# Altium schematic sheet Block_Scheme.SchDoc
size 420 x 297 mm; DocumentNumber: СКТБ.100.001 Э3; SheetNumber: 4; Format: A3
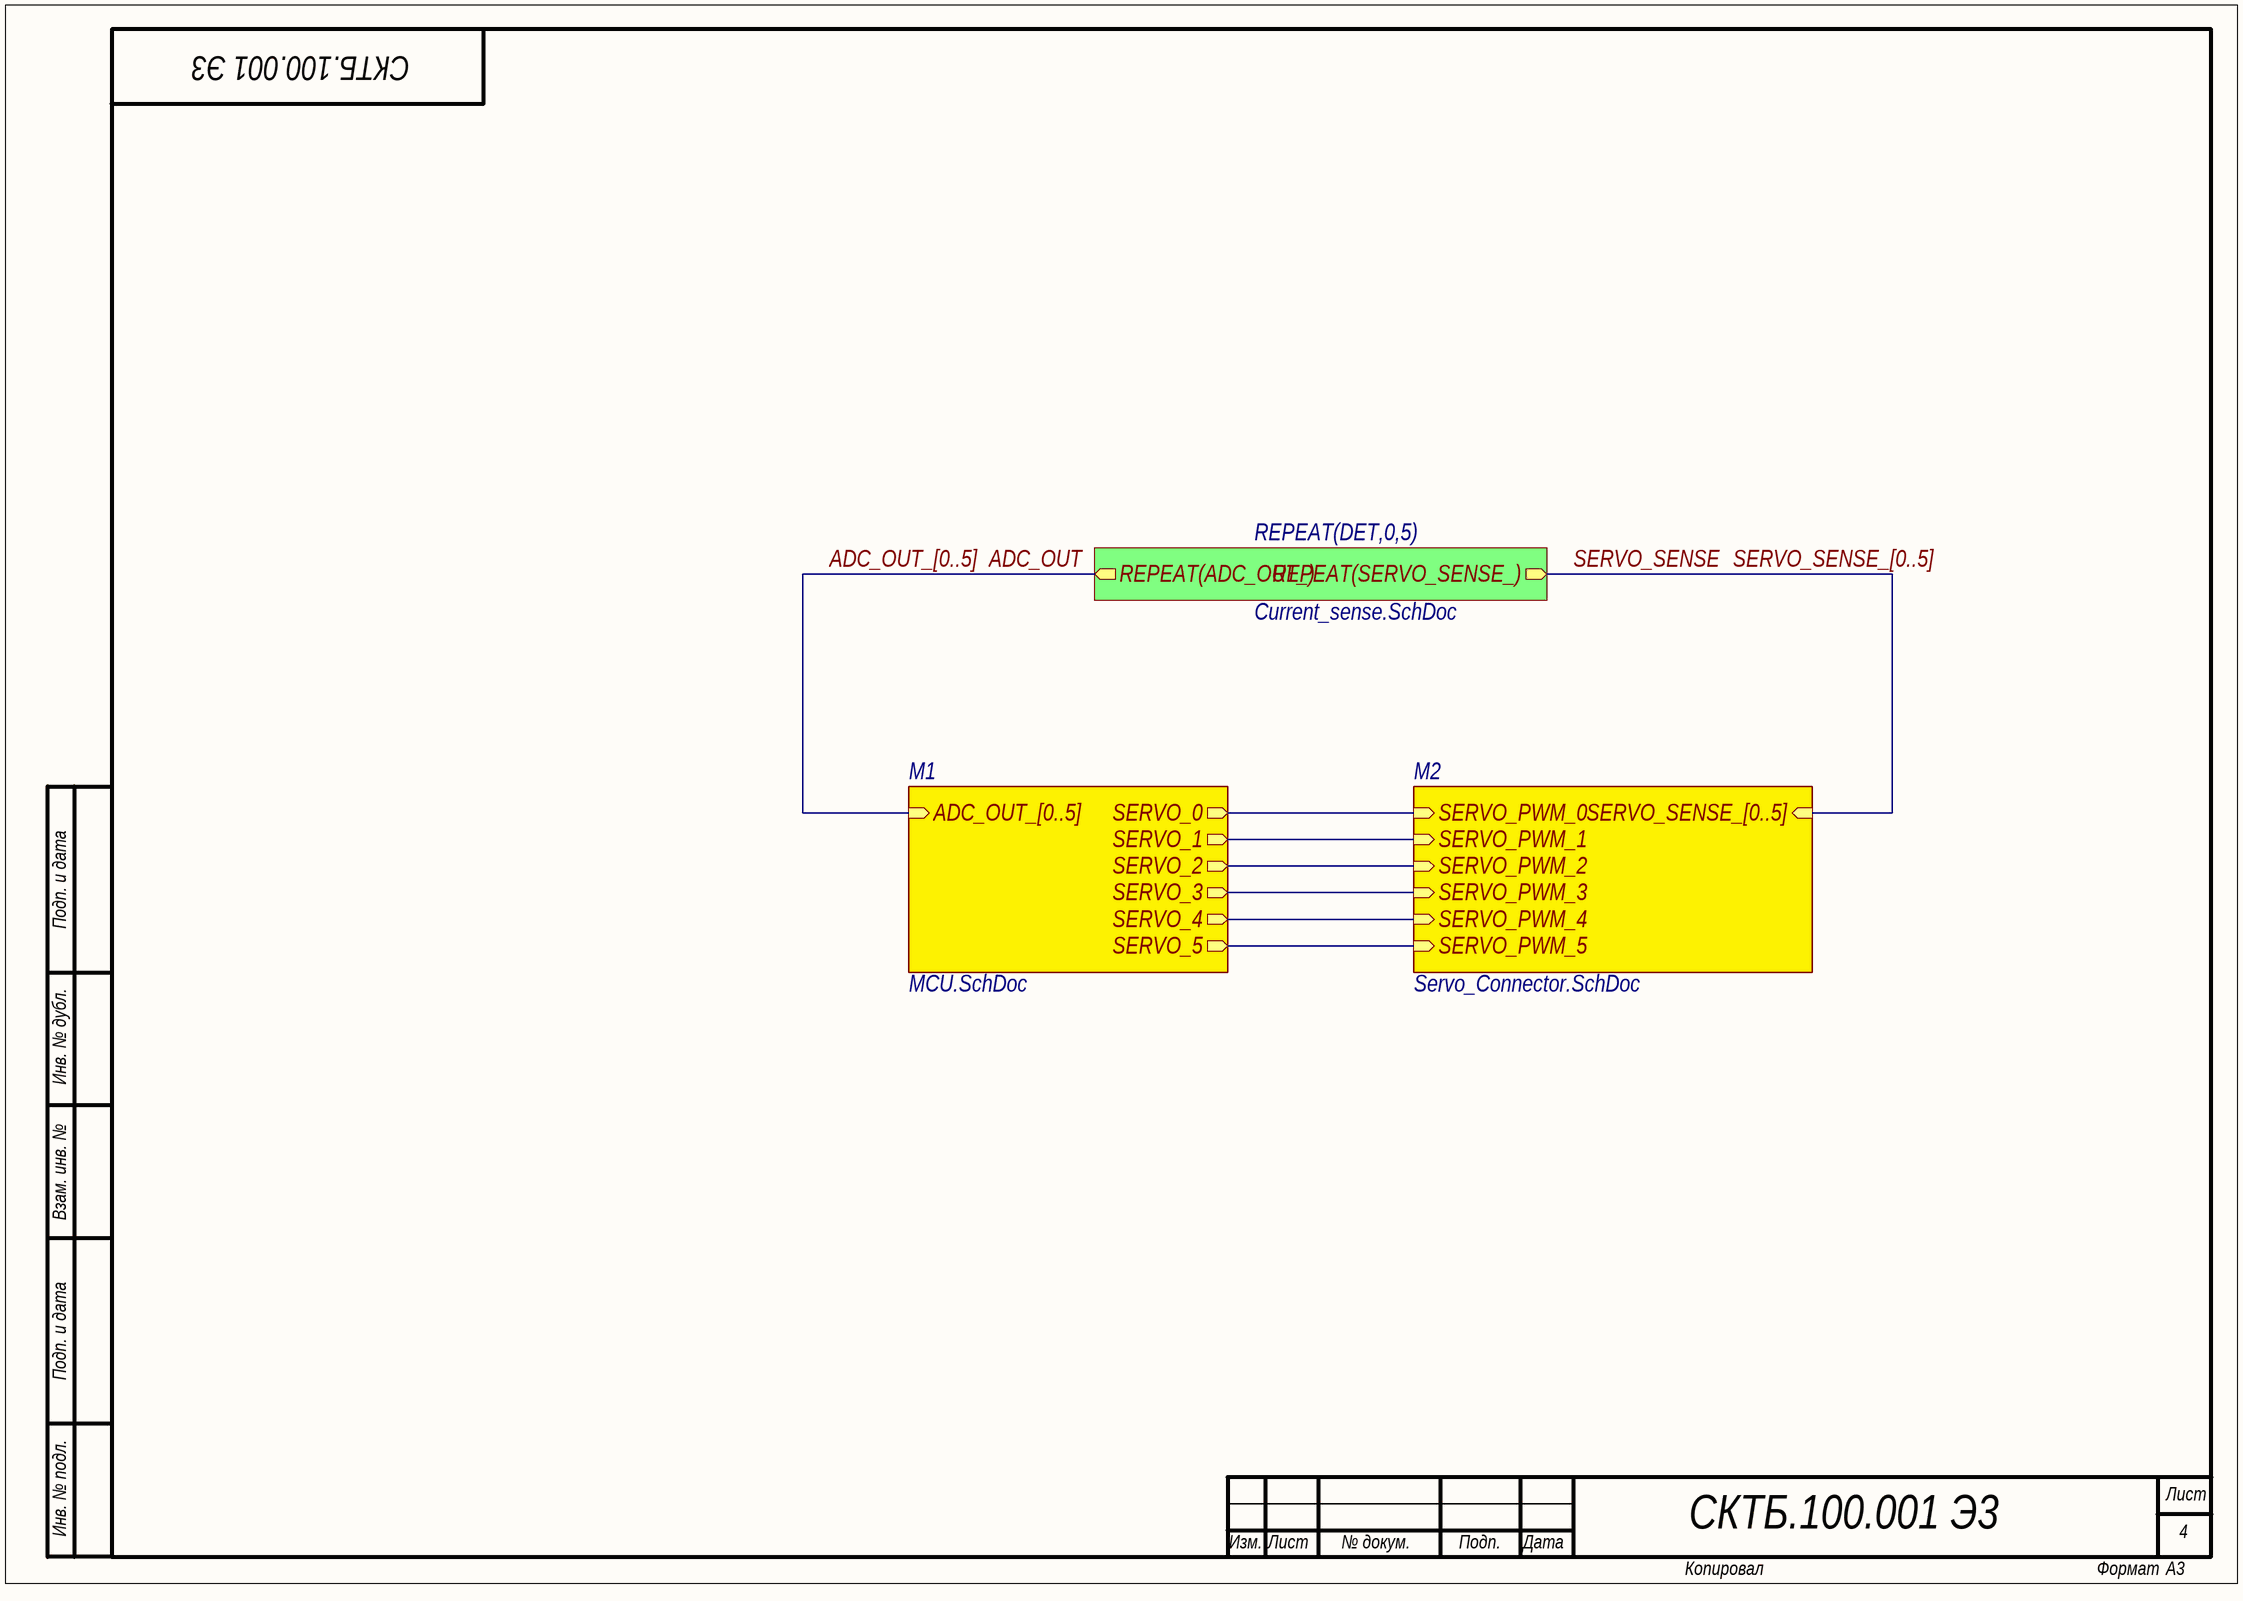
[diagram p0: Block_Scheme.SchDoc]

## Sub-sheets
M1 = MCU.SchDoc: ADC_OUT_[0..5] (in), SERVO_1 (out), SERVO_0 (out), SERVO_2 (out), SERVO_3 (out), SERVO_4 (out), SERVO_5 (out)
M2 = Servo_Connector.SchDoc: SERVO_SENSE_[0..5] (in), SERVO_PWM_5 (in), SERVO_PWM_4 (in), SERVO_PWM_3 (in), SERVO_PWM_2 (in), SERVO_PWM_1 (in), SERVO_PWM_0 (in)
REPEAT(DET,0,5) = Current_sense.SchDoc: REPEAT(ADC_OUT_) (out), REPEAT(SERVO_SENSE_) (out)

## Nets
ADC_OUT: sheet REPEAT(DET,0,5)/REPEAT(ADC_OUT_)
SERVO_SENSE: sheet REPEAT(DET,0,5)/REPEAT(SERVO_SENSE_)
(unnamed): sheet M1/SERVO_1, sheet M2/SERVO_PWM_1
(unnamed): sheet M1/SERVO_0, sheet M2/SERVO_PWM_0
(unnamed): sheet M1/SERVO_2, sheet M2/SERVO_PWM_2
(unnamed): sheet M1/SERVO_3, sheet M2/SERVO_PWM_3
(unnamed): sheet M1/SERVO_4, sheet M2/SERVO_PWM_4
(unnamed): sheet M1/SERVO_5, sheet M2/SERVO_PWM_5

## Buses and harness runs
bus ADC_OUT_[0..5] = sheet M1/ADC_OUT_[0..5]
bus SERVO_SENSE_[0..5] = sheet M2/SERVO_SENSE_[0..5]

## Notes on the sheet
- Подп. и дата
- Инв. № дубл.
- Взам. инв. №
- Инв. № подл.
- Лист
- Изм.
- № докум.
- Подп.
- Дата
- Копировал
- Формат